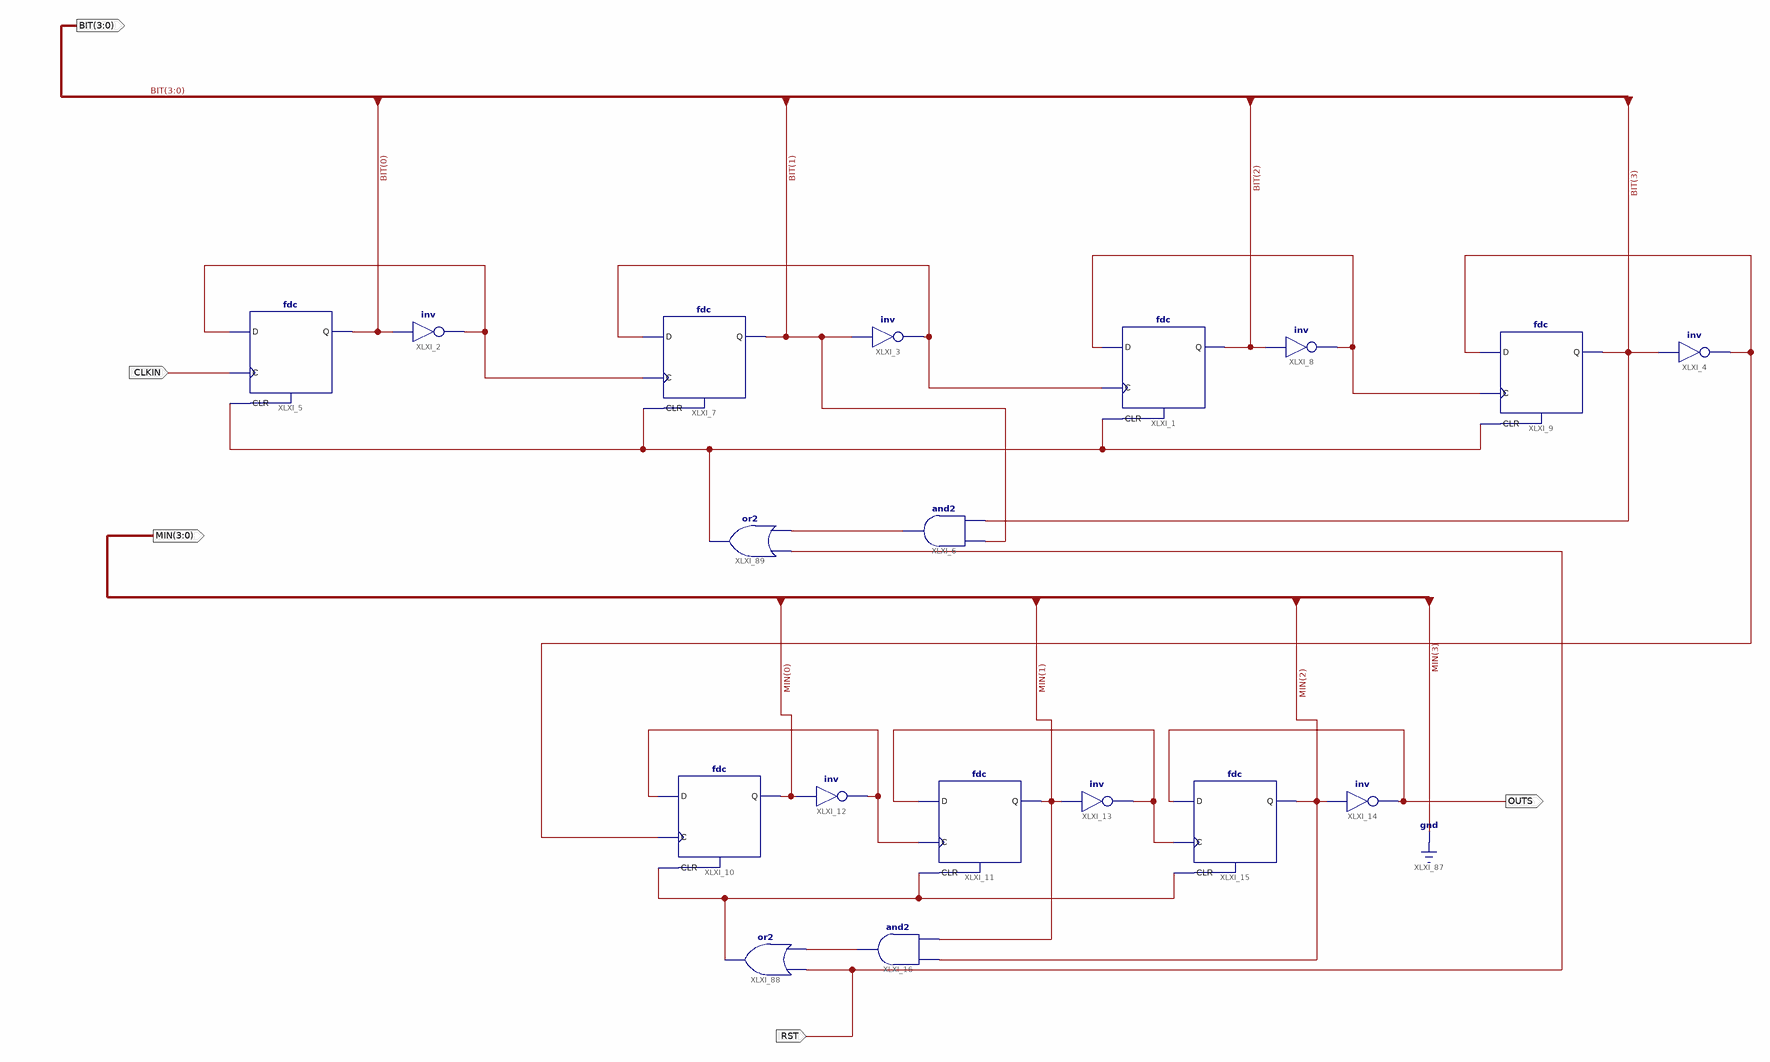
[diagram p0: schematic sheet 1]
// Xilinx ISE schematic SecondCounter.sch (spartan6) as structural Verilog: 18 symbols, 5 ports
module SecondCounter (
  input  CLKIN,
  input  RST,
  output [3:0] BIT,
  output OUTS,
  output [3:0] MIN
);

  wire CLKOUT, XLXN_6, XLXN_7, XLXN_9, XLXN_13, XLXN_33, XLXN_36, XLXN_44, XLXN_46, XLXN_47;

  fdc XLXI_1 (.C(XLXN_9), .CLR(XLXN_13), .D(XLXN_6), .Q(BIT[2]));
  not XLXI_2 (XLXN_7, BIT[0]);
  not XLXI_3 (XLXN_9, BIT[1]);
  not XLXI_4 (CLKOUT, BIT[3]);
  fdc XLXI_5 (.C(CLKIN), .CLR(XLXN_13), .D(XLXN_7), .Q(BIT[0]));
  and XLXI_6 (XLXN_46, BIT[3], BIT[1]);
  fdc XLXI_7 (.C(XLXN_7), .CLR(XLXN_13), .D(XLXN_9), .Q(BIT[1]));
  not XLXI_8 (XLXN_6, BIT[2]);
  fdc XLXI_9 (.C(XLXN_6), .CLR(XLXN_13), .D(CLKOUT), .Q(BIT[3]));
  fdc XLXI_10 (.C(CLKOUT), .CLR(XLXN_44), .D(XLXN_36), .Q(MIN[0]));
  fdc XLXI_11 (.C(XLXN_36), .CLR(XLXN_44), .D(XLXN_33), .Q(MIN[1]));
  not XLXI_12 (XLXN_36, MIN[0]);
  not XLXI_13 (XLXN_33, MIN[1]);
  not XLXI_14 (OUTS, MIN[2]);
  fdc XLXI_15 (.C(XLXN_33), .CLR(XLXN_44), .D(OUTS), .Q(MIN[2]));
  and XLXI_16 (XLXN_47, MIN[1], MIN[2]);
  or XLXI_88 (XLXN_44, XLXN_47, RST);
  or XLXI_89 (XLXN_13, XLXN_46, RST);

  assign MIN[3] = 1'b0;
endmodule
